# Altium schematic sheet Sheet1.SchDoc
size A4; SheetNumber: 1; SheetTotal: 6
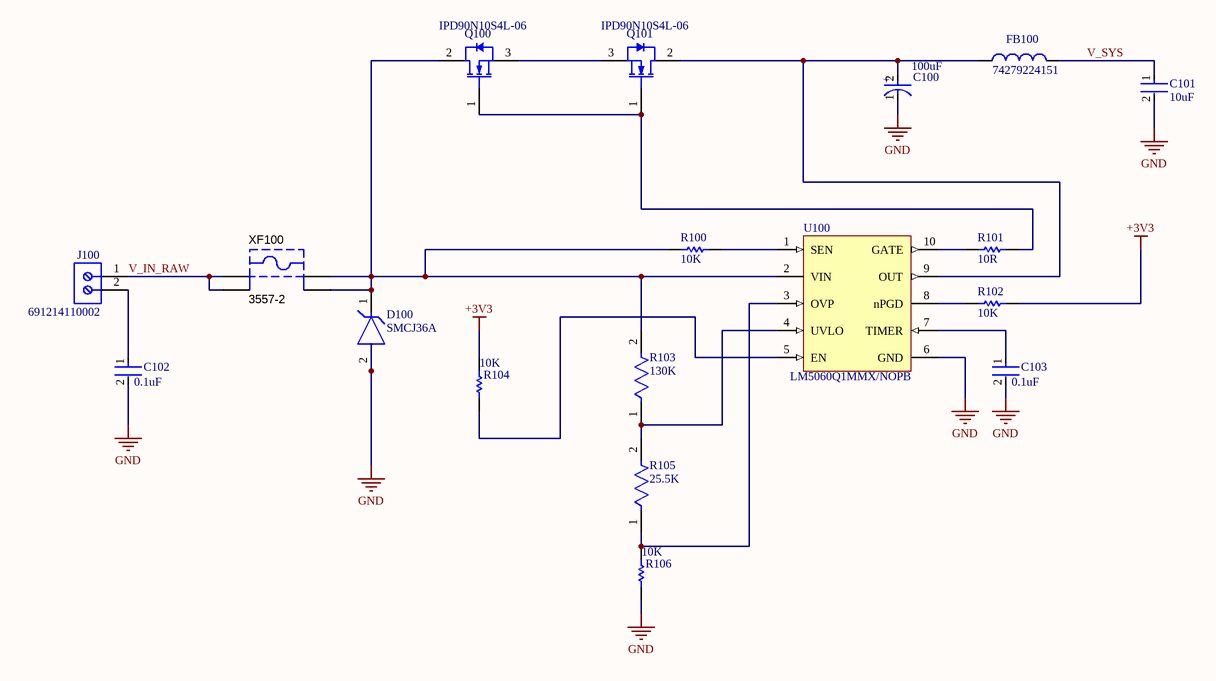
[diagram p0: Sheet1.SchDoc]

## Parts
C100  100uF  [FP-RAD-TH-D_8_0_5-L_11_5-MFG]
C101  10uF  [FP-C3225-250-0_4-IPC_A]
C102  0.1uF  [FP-C1206C-EB-MFG]
C103  0.1uF  [FP-C1206C-EB-MFG]
D100  SMCJ36A  [FP-SMCJ-MFG]
FB100  74279224151  [WE-MPSB_2220_L5.6W5.1H1.8]
J100  691214110002  [691214110002]
Q100  IPD90N10S4L-06  [INF-PG-TO252-3-313_M]
Q101  IPD90N10S4L-06  [INF-PG-TO252-3-313_M]
R100  10K  [RESC1609X50X30NL8T20]
R101  10R  [RESC1608X55X25NL10T15]
R102  10K  [RESC1609X50X30NL8T20]
R103  130K  [FP-CRCW0603-e3-IPC_C]
R104  10K  [RESC1609X50X30NL8T20]
R105  25.5K  [FP-CRCW0603-e3-IPC_A]
R106  10K  [RESC1609X50X30NL8T20]
U100  LM5060Q1MMX/NOPB  [DGS0010A_M]
XF100  3557-2  [KSTN-3557-2]

## Nets
+3V3: R102.1 R104.2
GND: C100.1(C) C101.2 C102.2 C103.2 D100.2(A) R106.1 U100.6(GND)
V_IN_RAW: J100.1 XF100.1 XF100.2
V_SYS: C101.1 FB100.2
NetC100_2: C100.2(A) FB100.1 Q101.2(DRAIN) U100.9(OUT)
NetC102_1: C102.1 J100.2
NetC103_1: C103.1 U100.7(TIMER)
NetD100_1: D100.1(C) Q100.2(DRAIN) R100.2 R103.2 U100.2(VIN) XF100.3 XF100.4
NetQ100_1: Q100.1(GATE) Q101.1(GATE) R101.2
NetQ100_3: Q100.3(SOURCE) Q101.3(SOURCE)
NetR100_1: R100.1 U100.1(SEN)
NetR101_1: R101.1 U100.10(GATE)
NetR102_2: R102.2 U100.8(nPGD)
NetR103_1: R103.1 R105.2 U100.4(UVLO)
NetR104_1: R104.1 U100.5(EN)
NetR105_1: R105.1 R106.2 U100.3(OVP)

## Notes on the sheet
- (in symbol CMP-05427-002079-1) +

## Library data of the parts
C100 = CMP-05427-002079-1: Aluminum Electrolytic Capacitors (Radial Lead Type) 100uF ±20% 50V; ESR (Equivalent Series Resistance): 61mR; Lead Diameter: 0.6mm; Ripple Current (AC): 870mA; Life (Hours): 6000Hour; Lead/Base Style: Straight; Height - Seated (Max): 0.512inch; Height: 11.5mm; REACH SVHC: No SVHC; Contact Plating: Tin; Impedance: 61mR; Capacitance: 100uF; Voltage: 50V; Termination: Radial; Series: FR; Voltage Rating: 50V; Lead Pitch: 3.5mm; Diameter: 8mm; Number of Pins: 2; Min Operating Temperature: -40°C; Mount: Through Hole; Ripple Current: 870mA; Radiation Hardening: No; Length: 11.5mm; Max Operating Temperature: 105°C; Construction: RADIAL; Packaging: Bulk; Package Quantity: 200; Case/Package: Radial; RoHS Compliant: Yes; Voltage Rating (DC): 50V; Tolerance: 20%
C101 = CMP-08246-007101-1: Multilayer Ceramic Capacitors 10uF ±10% 50V X7R SMD 1210; RoHS Compliant: Yes
C102 C103 = CMP-03020-005759-1: CAP CER 0.1UF 50V X7R 1206; Manufacturer: KEMET; Manufacturer Part Number: C1206C104K5RACAUTO; Capacitance: 0.10 μF; Temperature Coefficient: 15%; Value: 0.10 μF; Material: Ceramic; Automotive Grade: Grade 0; Tolerance: 0.1; RoHS: TRUE; Lead Free: Yes; ComponentLink2Description: Datasheet; Automotive: Yes; Temperature Characteristic: X7R; Temperature Range Low: -55°C; Voltage Rating: 50 V; Device Class L1: Passive Components; Ipc Land Pattern Name: CAPC320160X78; Mouser Description: Multilayer Ceramic Capacitors MLCC - SMD/SMT 0.1uF 50volts 10% X7R AUTO; Octopart: https://octopart.com/c1206c104k5racauto-kemet-12595586; Device Class L3: Ceramic Capacitors; Digikey Description: CAP CER 0.1UF 50V X7R 1206; Temperature Range High: +150°C; Temperature: -55°C to +150°C; Device Class L2: Capacitors; ComponentLink2URL: https://content.kemet.com/datasheets/KEM_C1007_X8R_ULTRA_150C_SMD.pdf; Package: C1206C-EB; Category: Cap; Height: 0.88mm
D100 = CMP-2000-07108-2: TVS DIODE 36V 58.1V DO214AB; Max Reverse Leakage Current: 1uA; Max Surge Current: 25.9A; Min Breakdown Voltage: 40V; Peak Pulse Power: 1.5kW; Polarity: Unidirectional; Number of Elements: 1; Max Power Dissipation: 6.5W; Max Breakdown Voltage: 44.2V; Power Line Protection: No; Test Current: 1mA; Element Configuration: Single; Case/Package: SMC; Peak Pulse Current: 25.9A; Length: 7.11mm; Height: 2.417mm; Power Dissipation: 1.5kW; Max Operating Temperature: 150°C; Direction: Unidirectional; Min Operating Temperature: -65°C; Operating Supply Voltage: 36V; Breakdown Voltage: 40V; Reverse Standoff Voltage: 36V; REACH SVHC: No SVHC; Lead Free: Lead Free; Voltage Rating (DC): 36V; Number of Channels: 1; Number of Unidirectional Channels: 1; Mount: Surface Mount; Clamping Voltage: 58.1V; Number of Pins: 2; Composition: Zener; Termination: SMD/SMT; Reverse Breakdown Voltage: 40V; Leakage Current: 1uA; Width: 6.22mm; Radiation Hardening: No; Packaging: Tape and Reel; Package Quantity: 3000
FB100 = CMP-1413-00001-2: NexarPartId: 21273886; Current Rating: 5A; Tolerance: 25%; Number of Lines: 1; Frequency: 700MHz; DC Resistance (DCR): 7mΩ; Test Frequency: 100MHz; Material: Ferrite, Steel; Impedance: 150Ω; Max Operating Temperature: 125°C; Length: 5.6mm; Width: 5.1mm; Height: 1.8mm; Max DC Current: 5A; Case Code (Metric): 5650; RoHS: Compliant; Termination: SMD/SMT; Packaging: Digi-Reel®; Depth: 5.08mm; Max Current Rating: 5A; REACH SVHC: Unknown; Case Code (Imperial): 2220; Min Operating Temperature: -55°C; Case/Package: 2220; Mount: Surface Mount
J100 = CMP-1502-02464-3: 2141 Series 3.5MM Pitch Straight, Pcb Terminal Block, Through Hole, 2 Way; Plating: Brass, Steel; Wire Gauge (Min): 16AWG; Number of Contacts: 2; Current: 10A; Stripping Length: -6mm; Voltage Rating: 300V; Pitch: 3.5052mm; Wire Gauge (Max): 24AWG; Number of Levels: 1; Lead Pitch: 3.5mm; Width: 7.9mm; Packaging: Box; RoHS: Compliant; Number of Rows: 1; Min Operating Temperature: -40°C; Mount: Through Hole; Number of Pins: 2; Contact Plating: Brass, Tin; Housing Material: Nylon; Current Rating: 10A; Termination: Screw; Color: Blue, Green; Number of Positions Per Level: 2; Height: 8.7mm; Voltage: 300V; Max Operating Temperature: 105°C; Wire/Cable Gauge: 24AWG; Length: 7.4mm; Contact Material: Tin
Q100 Q101 = CMP-1138-00161-1: OptiMOS-T2 Power-Transistor, 100 V VDS, 90 A ID, PG-TO252-3-313, Reel, Green; Manufacturer: Infineon; RthJC (max): 1.1 K/W; VGS(th) (min): 1.1 V; IDpuls (max): 360 A; VDS (max): 100 V; RDS (on) (max) (@4.5V): 8.1 mOhm; ID (max): 90 A; Ptot (max): 136 W; RDS (on) (max) (@10V): 6.6 mOhm; Green: TRUE; VGS(th) (max): 2.1 V; QG: 75 nC; Halogen-free: TRUE; PackageVersion: Oct-10; Mounting Technology: Surface Mount; ComponentLink1Description: Manufacturer URL; ComponentLink2Description: Datasheet; ComponentLink1URL: http://www.infineon.com/; PackageReference: PG-TO252-3-313; Technology: OptiMOS-T2; ComponentLink3Description: Package Specification; Packing: Reel; DatasheetVersion: Rev. 1.0; ComponentLink3URL: http://www.infineon.com/dgdl/PG-TO252-3-313-Package_Overview.pdf?folderId=db3a30432b57a660012b81890ade72d2&fileId=db3a30432b57a660012b8193af2872eb; PackageDescription: 3-Pin Plastic (Green) Transistor Single Outline Package, 6.5 x 6.12 mm Body, 2.28 mm Pitch; ComponentLink2URL: http://www.infineon.com/dgdl/IPD90N10S4L-06_DS_1_0.pdf?folderId=db3a3043156fd5730115c7d50620107c&fileId=db3a3043372d5cc80137500063630512&location=en.Products.Automotive_ICs.Automotive_MOSFETs.Single__N-Channel_100V_MOSFETs.DATASHEET.IPD90N10S4L-06_DS_1_0.p; PartNumber: IPD90N10S4L-06
R100 R102 R104 R106 = CMP-1666-00005-4: Chip Resistor, 10 KOhm, +/- 1%, 100 mW, -55 to 155 degC, 0603 (1608 Metric), RoHS, Tape and Reel; Manufacturer: Vishay Semiconductor; Voltage Rating: 75 V; Max Operating Temperature: 155 degC; PackageDescription: 2-Pin Surface Mount Device, Body 1.575 x 0.85 mm; ComponentLink1Description: Manufacturer URL; RoHSCompliant: true; PackageReference: 0603; REACH SVHC: Unknown; Length: 1.55 mm; DatasheetVersion: 06/2012; Packaging: Tape and Reel; Min Operating Temperature: -55 degC; Mounting Technology: Surface Mount; ComponentLink2URL: https://datasheet.ciiva.com/11809/0900766b80d98afc-11809037.pdf; Height: 0.45 mm; ComponentLink2Description: Datasheet; Package Quantity: 5000; ComponentLink1URL: http://www.vishay.com/
R101 = CMP-1659-00008-4: Chip Resistor, 10 Ohm, +/- 1%, 0.1 W, -55 to 155 degC, 0603 (1608 Metric), RoHS, Tape and Reel; Manufacturer: Yageo; Voltage Rating: 50 V; PackageReference: 0603; ComponentLink3Description: Package Specification; Packaging: Tape and Reel; Max Operating Temperature: 155 degC; ComponentLink3URL: http://www.farnell.com/datasheets/443971.pdf; PackageDescription: 2-Pin Surface Mount Device, Body 1.6 x 0.8 mm; ComponentLink1URL: http://www.yageo.com/; Pins: 2; REACH SVHC: No SVHC; RoHSCompliant: true; ComponentLink2URL: http://www.yageo.com/documents/recent/PYu-RC_Group_51_RoHS_L_04.pdf; DatasheetVersion: Rev. 4, 02/2016; Mount: Surface Mount; Package Quantity: 200; Min Operating Temperature: -55 degC; Height: 0.45 mm; Mounting Technology: Surface Mount; ComponentLink1Description: Manufacturer URL; ComponentLink2Description: Datasheet; Length: 1.6 mm
R103 = CMP-2000-03887-2: RES Thick Film, 130kΩ, 1%, 0.1W, 100ppm/°C, 0603; Resistance: 130kR; Power Rating: 100mW; Voltage Rating: 75V; Width: 0.033inch; Lead Free: Lead Free; Case Code (Imperial): 0603; Radiation Hardening: No; Termination: SMD/SMT; Tolerance: 1%; Packaging: Tape and Reel; Length: 1.55mm; Height: 0.45mm; Composition: Thick Film; Max Power Dissipation: 100mW; Max Operating Temperature: 155°C; Temperature Coefficient: 100ppm/°C; Voltage Rating (DC): 75V; Case Code (Metric): 1608; Case/Package: 0603; Military Standard: Not; Features: Automotive AEC-Q200; Number of Pins: 2; Weight: 7.1E-05oz; Min Operating Temperature: -55°C; Depth: 0.85mm; Number of Terminations: 2; Contact Plating: Tin; Package Quantity: 10
R105 = CMP-2000-03129-2: RES Thick Film, 25.5kΩ, 1%, 0.1W, 100ppm/°C, 0603; Power Rating: 100mW; Voltage Rating (DC): 75V; Resistance: 25.5kR; Termination: SMD/SMT; Temperature Coefficient: 100ppm/°C; Lead Free: Lead Free; Features: Automotive AEC-Q200; Case/Package: 0603; Width: 0.033inch; Min Operating Temperature: -55°C; Number of Pins: 2; Package Quantity: 10; Case Code (Metric): 1608; Military Standard: Not; Case Code (Imperial): 0603; Length: 1.55mm; Composition: Thick Film; Max Operating Temperature: 155°C; Height: 0.45mm; Number of Terminations: 2; Packaging: Tape and Reel; Radiation Hardening: No; Depth: 0.85mm; Tolerance: 1%; Contact Plating: Tin; Working Voltage: 75V; Weight: 7.1E-05oz; Max Power Dissipation: 100mW; Voltage Rating: 75V
U100 = CMP-0069-01838-4: High-Side Protection Controller with Low Quiescent Current, 10-pin MSOP, Pb-Free; Manufacturer: Texas Instruments; PackageTopMarking: ZXTT*SZAB; High-Reliability: Y; CompType: Switcher; PackageDescription: Mini-SO, Molded, .118 x .118 x .034in Body, 10 Lead, .0197in Pitch; PowerWise: Y; PinCount: 10; Code_JEDEC: MO-187-BA; ComponentLink1URL: http://www.ti.com/general/docs/lit/getliterature.tsp?genericPartNumber=LM5060-Q1&fileType=pdf; ComponentLink1Description: Datasheet URL; PackageReference: DGS0010A; RoHS: Y; PartNumber: LM5060Q1MMX/NOPB
XF100 = CMP-2000-05461-1: FUSE HOLDER, PCB MOUNT, 500VAC, 20A, ROHS; Manufacturer: Keystone-Electronics; Number of Circuits: 1; Voltage: 500V; Fuseholder Type: Block; Fuse Type: Blade; Fuse Size: 0.43"Lx0.15"Wx0.64"H(10.92mmx3.81mmx16.25mm); For Use With/Related Products: ATC,ATO257,MINI897; Current Rating: 30A; Datasheet URL: http://datasheet.octopart.com/3557-2-Keystone-datasheet-15715937.pdf; Orientation: Vertical; Family: Fuseholders; Datasheet Version: Apr-13; Contact Finish: TinNickel; Mounting Type: PCB; Series: -; Category: CircuitProtection; Termination Style: PCPin; Contact Material: Brass; Manufacturer URL: http://www.keyelco.com/